# EAGLE design remote-tiny (EAGLE 4.16)
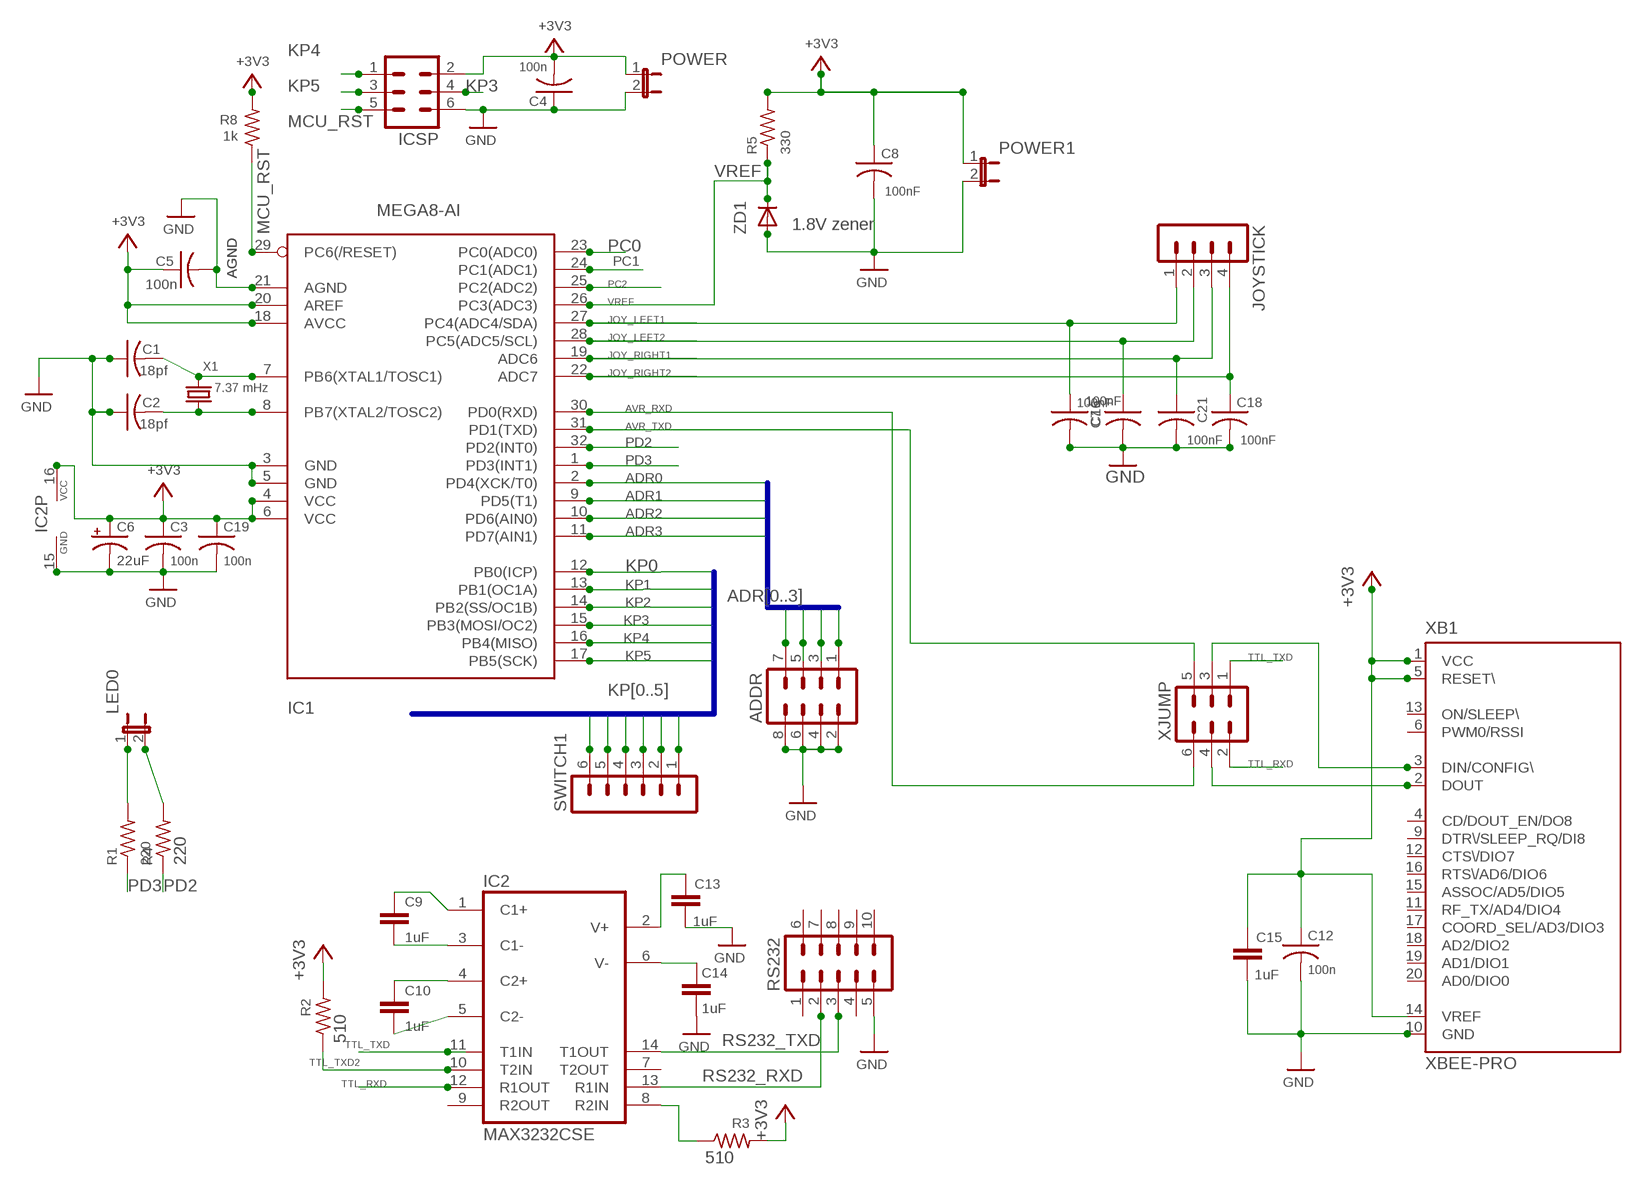
[diagram p0: schematic, sheet 1]

## Parts
ADDR  MA04-2  [MA04-2]
C1  18pf  C-USC1206  [C1206]
C2  18pf  C-USC1206  [C1206]
C3  100n  C-USC1206  [C1206]
C4  100n  C-USC1206  [C1206]
C5  100n  C-USC1206  [C1206]
C6  22uF  CPOL-USCT7343  [CT7343]
C7  100nF  C-USC1206  [C1206]
C8  100nF  C-USC1206  [C1206]
C9  1uF  C-EUC1206  [C1206]
C10  1uF  C-EUC1206  [C1206]
C12  100n  C-USC1206  [C1206]
C13  1uF  C-EUC1206  [C1206]
C14  1uF  C-EUC1206  [C1206]
C15  1uF  C-EUC1206  [C1206]
C16  100nF  C-USC1206  [C1206]
C18  100nF  C-USC1206  [C1206]
C19  100n  C-USC1206  [C1206]
C21  100nF  C-USC1206  [C1206]
IC1  MEGA8-AI  [TQFP32-08]
IC2  MAX3232CSE  [SO16]
ICSP  MA03-2  [MA03-2]
JOYSTICK  MA04-1  [MA04-1]
LED0  JP1E  [JP1]
POWER  JP1E  [JP1]
POWER1  JP1E  [JP1]
R1  220  R-US_M1206  [M1206]
R2  510  R-US_M1206  [M1206]
R3  510  R-US_M1206  [M1206]
R4  220  R-US_M1206  [M1206]
R5  330  R-US_M1206  [M1206]
R8  1k  R-US_M1206  [M1206]
RS232  COMHEADER-M  [MA05-2]
SWITCH1  MA06-1  [MA06-1]
X1  7.37 mHz  CRYSTALHC49UP  [HC49UP]
XB1  XBEE-PRO  [XBEE-PRO]
XJUMP  MA03-2  [MA03-2]
ZD1  1.8V zener  DIODE-SOD123  [SOD123]

## Nets
+3V3 [GND]: C3.1 C4.2 C5.1 C6.+ C8.1 C12.1 C15.1 C19.1 IC1.4(VCC) IC1.6(VCC) IC1.18(AVCC) IC1.20(AREF) IC2.16(VCC) ICSP.2 POWER1.1 POWER.1 R2.2 R3.2 R5.2 R8.2 XB1.1(VCC) XB1.5(RESET\) XB1.14(VREF)
ADR0: ADDR.7 IC1.2(PD4(XCK/T0))
ADR1: ADDR.5 IC1.9(PD5(T1))
ADR2: ADDR.3 IC1.10(PD6(AIN0))
ADR3: ADDR.1 IC1.11(PD7(AIN1))
AVR_RXD: IC1.30(PD0(RXD)) XJUMP.6
AVR_TXD: IC1.31(PD1(TXD)) XJUMP.5
GND [GND]: ADDR.2 ADDR.4 ADDR.6 ADDR.8 C1.1 C2.1 C3.2 C4.1 C5.2 C6.- C7.2 C8.2 C12.2 C13.2 C14.2 C15.2 C16.2 C18.2 C19.2 C21.2 IC1.3(GND) IC1.5(GND) IC1.21(AGND) IC2.15(GND) ICSP.6 POWER1.2 POWER.2 RS232.5 XB1.10(GND) ZD1.A
JOY_LEFT1: C16.1 IC1.27(PC4(ADC4/SDA)) JOYSTICK.1
JOY_LEFT2: C7.1 IC1.28(PC5(ADC5/SCL)) JOYSTICK.2
JOY_RIGHT1: C21.1 IC1.19(ADC6) JOYSTICK.3
JOY_RIGHT2: C18.1 IC1.22(ADC7) JOYSTICK.4
KP0: IC1.12(PB0(ICP)) SWITCH1.6
KP1: IC1.13(PB1(OC1A)) SWITCH1.5
KP2: IC1.14(PB2(SS/OC1B)) SWITCH1.4
KP3: IC1.15(PB3(MOSI/OC2)) ICSP.4 SWITCH1.3
KP4: IC1.16(PB4(MISO)) ICSP.1 SWITCH1.2
KP5: IC1.17(PB5(SCK)) ICSP.3 SWITCH1.1
MCU_RST: IC1.29(PC6(/RESET)) ICSP.5 R8.1
N$1: IC2.8(R2IN) R3.1
N$3: LED0.2 R4.2
N$4 [GND]: C1.2 IC1.7(PB6(XTAL1/TOSC1)) X1.2
N$5: LED0.1 R1.2
N$7: C14.1 IC2.6(V-)
N$9 [GND]: C2.2 IC1.8(PB7(XTAL2/TOSC2)) X1.1
N$10: C10.1 IC2.4(C2+)
N$11: C13.1 IC2.2(V+)
N$12: C10.2 IC2.5(C2-)
N$13: C9.2 IC2.3(C1-)
N$15: C9.1 IC2.1(C1+)
PC0: IC1.23(PC0(ADC0))
PC1: IC1.24(PC1(ADC1))
PC2: IC1.25(PC2(ADC2))
PD2: IC1.32(PD2(INT0)) R4.1
PD3: IC1.1(PD3(INT1)) R1.1
RS232_RXD: IC2.13(R1IN) RS232.2
RS232_TXD: IC2.14(T1OUT) RS232.3
TTL_RXD: IC2.12(R1OUT) XJUMP.2
TTL_TXD: IC2.11(T1IN) XJUMP.1
TTL_TXD2: IC2.10(T2IN) R2.1
VREF: IC1.26(PC3(ADC3)) R5.1 ZD1.C
XB_SEND: XB1.3(DIN/CONFIG\) XJUMP.3
XBEE_RCV: XB1.2(DOUT) XJUMP.4
Unconnected: IC2.7(T2OUT) IC2.9(R2OUT) RS232.1 RS232.4 RS232.6 RS232.7 RS232.8 RS232.9 RS232.10 XB1.4(CD/DOUT_EN/DO8) XB1.6(PWM0/RSSI) XB1.9(DTR\/SLEEP_RQ/DI8) XB1.11(RF_TX/AD4/DIO4) XB1.12(CTS\/DIO7) XB1.13(ON/SLEEP\) XB1.15(ASSOC/AD5/DIO5) XB1.16(RTS\/AD6/DIO6) XB1.17(COORD_SEL/AD3/DIO3) XB1.18(AD2/DIO2) XB1.19(AD1/DIO1) XB1.20(AD0/DIO0)

## Buses
ADR[0..3]
KP[0..5]

## Notes on the sheet
- AGND | AGND

## Library data of the parts
ADDR = con-lstb:MA04-2: PIN HEADER
C1-C5 C7 C8 C12 C16 C18 C19 C21 = rcl:C-US: CAPACITOR, American symbol
C6 = rcl:CPOL-US: POLARIZED CAPACITOR, American symbol
C9 C10 C13-C15 = rcl:C-EU: CAPACITOR, European symbol
IC1 = atmel:MEGA8: MICROCONTROLLER 8 Kbytes FLASH 1 kbytes SRAM 512 bytes EEPROM USART 6-channel 10 bit ADC 2-channel 8 bit ADC Source: avr.lbr
IC2 = maxim:MAX3232*: True RS-232 Transceivers 3.0V to 5.5V, Low-Power up to 1Mbps, Using Four 0.1µF External Capacitors Source: http://pdfserv.maxim-ic.com/en/ds/MAX3222-MAX3241.pdf
ICSP XJUMP = con-lstb:MA03-2: PIN HEADER
JOYSTICK = con-lstb:MA04-1: PIN HEADER
LED0 POWER POWER1 = jumper:JP1E: JUMPER
R1-R5 R8 = rcl:R-US_: RESISTOR, American symbol
RS232 = foote:COMHEADER-M
SWITCH1 = con-lstb:MA06-1: PIN HEADER
X1 = crystal:CRYSTAL: CRYSTAL
XB1 = maxstream:XBEE: XBee (TM) /XBee-PRO(TM) OEM RF Modules Source: MaxStream, Inc. xbee_productmanual.pdf
ZD1 = diode:DIODE-: DIODE

## Board
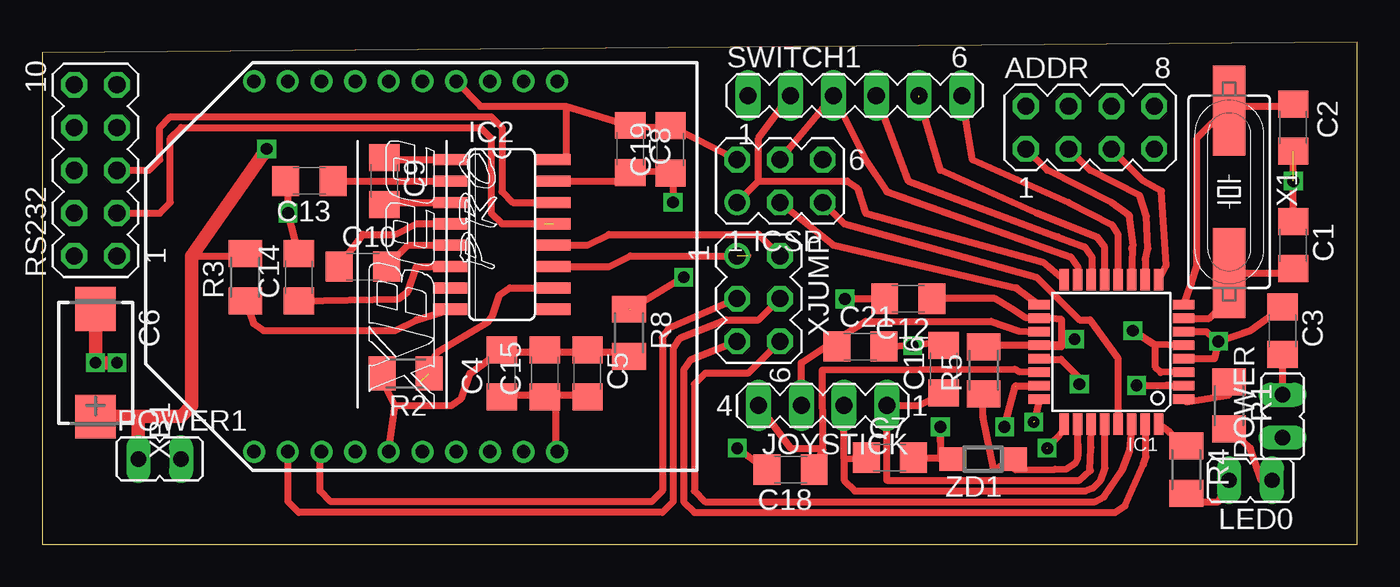
[diagram p1: board, top side]
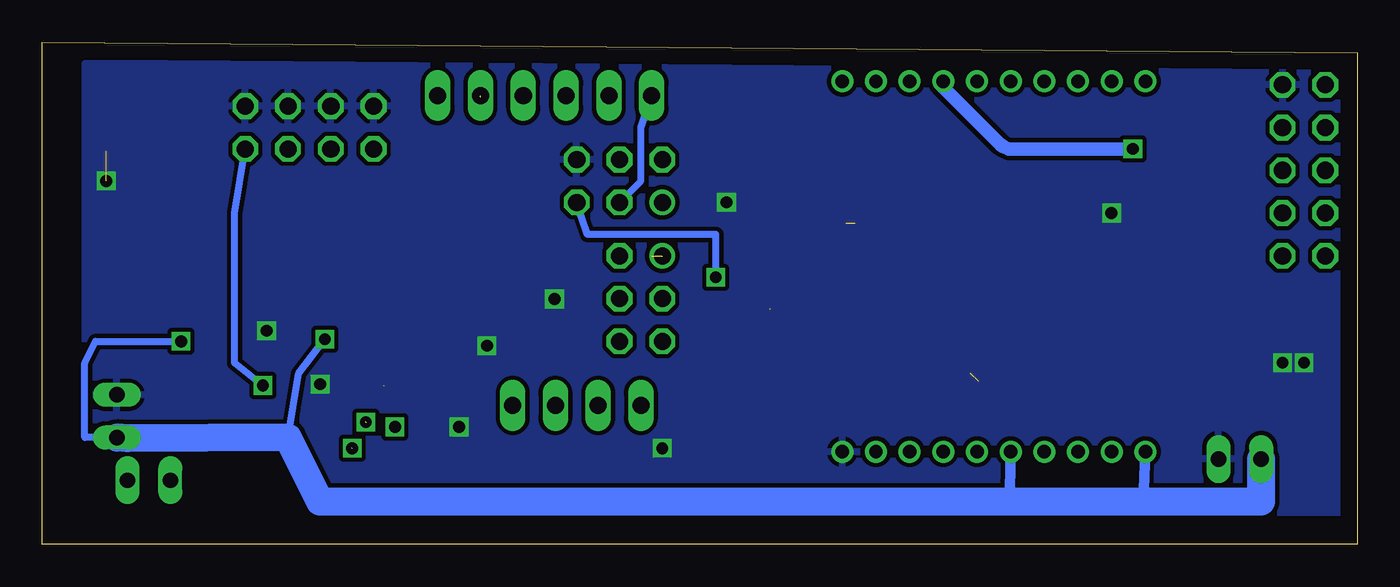
[diagram p2: board, bottom side, seen from below]

Size 78.11 x 29.84 mm. Coordinates in mm from the lower left corner, seen from the top.
Outline: 0,0 78.11,0 78.11,29.84 0,29.21 0,0
Copper layers (1*16): Top 0.035mm / dielectric 1.5mm / Bottom 0.035mm
Design rules "default": minimum track width 10mil, minimum drill 24mil, track to track 8mil, track to pad 8mil, pad to pad 8mil, via to via 8mil, smd to smd 8mil, copper to edge 40mil, drill to drill 8mil, minimum pad ring 10mil, minimum via ring 8mil, stop-mask expansion 4mil, vias tented up to drill 0mil, thermal gap 10mil

### Footprints (pad centres in the part's own frame; a part is rotated, then mirrored left to right if it is on the bottom)
MA04-2 = drill 1.016 octagon: 1 -3.81,-1.27; 2 -3.81,1.27; 3 -1.27,-1.27; 4 -1.27,1.27; 5 1.27,-1.27; 6 1.27,1.27; 7 3.81,-1.27; 8 3.81,1.27
C1206 = smd 1.6 x 1.8: 1 -1.4,0; 2 1.4,0
CT7343 = smd 2.6 x 2.4: + 3.2,0; - -3.2,0
TQFP32-08 = smd 1.27 x 0.559: 1 -4.293,2.8; 2 -4.293,2; 3 -4.293,1.2; 4 -4.293,0.4; 5 -4.293,-0.4; 6 -4.293,-1.2; 7 -4.293,-2; 8 -4.293,-2.8; 17 4.293,-2.8; 18 4.293,-2; 19 4.293,-1.2; 20 4.293,-0.4; 21 4.293,0.4; 22 4.293,1.2; 23 4.293,2; 24 4.293,2.8 | smd 0.559 x 1.27: 9 -2.8,-4.293; 10 -2,-4.293; 11 -1.2,-4.293; 12 -0.4,-4.293; 13 0.4,-4.293; 14 1.2,-4.293; 15 2,-4.293; 16 2.8,-4.293; 25 2.8,4.293; 26 2,4.293; 27 1.2,4.293; 28 0.4,4.293; 29 -0.4,4.293; 30 -1.2,4.293; 31 -2,4.293; 32 -2.8,4.293
SO16 = smd 0.66 x 2.032: 1 -4.445,-3.073; 2 -3.175,-3.073; 3 -1.905,-3.073; 4 -0.635,-3.073; 5 0.635,-3.073; 6 1.905,-3.073; 7 3.175,-3.073; 8 4.445,-3.073; 9 4.445,3.073; 10 3.175,3.073; 11 1.905,3.073; 12 0.635,3.073; 13 -0.635,3.073; 14 -1.905,3.073; 15 -3.175,3.073; 16 -4.445,3.073
MA03-2 = drill 1.016 round: 1 -2.54,-1.27 | drill 1.016 octagon: 2 -2.54,1.27; 3 0,-1.27; 4 0,1.27; 5 2.54,-1.27; 6 2.54,1.27
MA04-1 = drill 1.016 long: 1 -3.81,0; 2 -1.27,0; 3 1.27,0; 4 3.81,0
JP1 = drill 0.914 long: 1 0,-1.27; 2 0,1.27
M1206 = smd 1.6 x 2: 1 -1.4,0; 2 1.4,0
MA05-2 = drill 1.016 octagon: 1 -5.08,-1.27; 2 -2.54,-1.27; 3 0,-1.27; 4 2.54,-1.27; 5 5.08,-1.27; 6 -5.08,1.27; 7 -2.54,1.27; 8 0,1.27; 9 2.54,1.27; 10 5.08,1.27
MA06-1 = drill 1.016 long: 1 -6.35,0; 2 -3.81,0; 3 -1.27,0; 4 1.27,0; 5 3.81,0; 6 6.35,0
HC49UP = smd 5.334 x 1.93: 1 -4.826,0; 2 4.826,0
XBEE-PRO = drill 0.8 pad 1.27 round: 1 -11,9; 2 -11,7; 3 -11,5; 4 -11,3; 5 -11,1; 6 -11,-1; 7 -11,-3; 8 -11,-5; 9 -11,-7; 10 -11,-9; 11 11,-9; 12 11,-7; 13 11,-5; 14 11,-3; 15 11,-1; 16 11,1; 17 11,3; 18 11,5; 19 11,7; 20 11,9
SOD123 = smd 1.4 x 1.4: A 1.9,0; C -1.9,0

### Placement (x,y rotation side)
ADDR  62.23,24.77 0 top
C1  74.3,17.78 270 top
C2  74.3,24.77 90 top
C3  73.66,12.7 270 top
C4  27.3,10.16 90 top
C5  32.38,10.16 270 top
C6  3.17,10.79 270 top
C7  50.34,5.16 0 top
C8  34.92,23.5 270 top
C9  20.32,21.59 270 top
C10  19.05,16.51 0 top
C12  51.44,14.61 180 top
C13  15.88,21.59 180 top
C14  15.24,15.88 90 top
C15  29.84,10.16 270 top
C16  53.54,10.41 90 top
C18  44.45,4.45 180 top
C19  37.31,23.47 270 top
C21  48.59,11.76 0 top
IC1  63.5,11.43 180 top
IC2  27.3,18.41 270 top
ICSP  43.81,21.59 0 top
JOYSTICK  46.35,8.26 180 top
LED0  71.75,3.81 90 top
POWER  73.66,7.62 0 top
POWER1  6.99,5.08 270 top
R1  70.48,8.26 270 top
R2  21.59,10.16 180 top
R3  12.06,15.88 90 top
R4  67.94,4.45 270 top
R5  55.91,10.34 90 top
R8  34.85,12.57 270 top
RS232  3.17,22.22 90 top
SWITCH1  48.26,26.67 0 top
X1  70.48,20.95 270 top
XB1  21.59,16.51 90 top
XJUMP  42.55,14.61 270 top
ZD1  55.88,5.08 180 top

### Tracks (layer width: path | path; a pad name or v marks a point on that pad's centre or on a via)
+3V3  (via drill 0.7)
  Top 0.406: IC1.20 60.43,11.84 61.29,12.06 v61.32,12.19 | IC1.4 69.61,11.03 v69.85,12.06 | C3.1 71.75,12.7 v69.85,12.06 | IC1.6 69.14,12.63 v69.85,12.06 | IC1.18 | IC1.20 60.55,11.73 60.55,13.36 59.28,13.49 IC1.18 | R5.2 55.83,11.81 IC1.20 | C12.1 56.59,14.61 57.56,14.02 58.42,13.46 59.31,13.41 IC1.18 | XB1.1 12.7,5.71 | XB1.5 20.95,8.26 | 20.95,8.26 24.31,8.26 24.91,8.69 25.4,10.16 C4.2 27.3,11.43 29.84,11.43 C15.1 29.21,11.43 32.38,11.43 | 31.11,26.04 C8.1 36.83,24.77 C19.1 ICSP.2 | 31.11,26.04 31.11,22.86 IC2.16 | 31.11,26.04 26.04,26.04 XB1.14 | 8.89,17.14 12.06,17.14 R3.2 | 32.38,11.43 C5.1 | R2.2 20.32,9.53 20.95,8.26 | 32.38,11.43 34.29,11.43 34.92,10.79 R8.2
  Top 0.813: POWER1.1 5.71,7.62 | C6.+ 3.17,7.62 5.71,7.62 | 5.71,7.62 8.26,7.62 8.89,8.26 8.89,17.14 v13.34,23.5
  Bottom 0.406: v61.32,12.19 62.87,10.16 63.5,6.35 | v69.85,12.06 74.93,12.06 75.56,10.79 75.56,6.35 73.03,6.35 73.03,6.31
  Bottom 0.61: 20.62,2.54 20.62,3.35 XB1.5 | 5.71,2.54 12.7,2.54 XB1.1
  Bottom 0.813: XB1.14 24.77,27.3 21.23,23.77 21.02,23.63 20.69,23.5 v13.34,23.5
  Bottom 1.676: POWER1.1 5.71,2.54 20.62,2.54 61.59,2.54 63.5,6.35 73.03,6.31 POWER.1
ADR0  (via drill 0.7)
  Top 0.406: 66.78,9.45 IC1.2 | v65,9.45 66.78,9.45 | 66.78,9.45 66.89,9.45
  Bottom 0.406: v65,9.45 66.67,10.79 66.67,19.68 ADDR.7
ADR1
  Top 0.406: IC1.9 66.76,16.56 66.47,21.01 65.41,21.59 ADDR.5
ADR2
  Top 0.406: IC1.10 65.53,15.75 65.53,16.92 | 65.53,16.92 65.53,16.94 | 65.53,16.92 65.51,16.92 65.67,17.59 65.58,19.51 65.18,20.73 62.23,22.22 ADDR.3
ADR3
  Top 0.406: IC1.11 64.77,17.6 | 64.77,17.6 64.72,17.65 | 64.77,17.6 64.69,17.58 64.79,17.77 64.57,19.53 63.5,20.32 59.69,22.22 ADDR.1
AVR_RXD
  Top 0.406: XJUMP.6 41.91,10.16 39.37,10.16 38.73,9.53 38.73,3.17 39.37,2.54 62.52,2.54 63.05,2.82 64.14,4.45 64.59,5.59 64.75,7.11 IC1.30
AVR_TXD
  Top 0.406: IC1.31 65.53,7.09 65.53,5.23 65.56,5.23 65.41,4.75 64.3,2.28 63.72,1.91 38.73,1.91 38.1,2.54 38.1,10.37 38.5,10.96 XJUMP.5
GND  (via drill 0.7)  (1 unrouted)
  Top 0.406: IC1.21 59.24,11 60.5,11 61.59,9.91 v61.59,9.53 | 14.61,17.14 C14.2 v14.61,19.68 14.61,21.46 C13.2 | C18.2 v41.27,5.71 | C21.2 v51.69,11.81 53.34,12.06 C16.2 | C7.2 53.37,5.16 v53.34,6.98 53.34,5.08 ZD1.A | IC1.5 65.94,11.91 v64.77,12.7 66.12,11.84 66.12,10.52 66.42,10.21 IC1.3 | 74.3,19.05 C1.1 C2.1 | POWER.2 C3.2 | v47.68,14.58 47.7,14.61 C12.2 | IC2.15 34.92,21.59 C8.2 37.47,22.22 C19.2 37.47,21.59 v37.47,20.32 | C4.1 27.3,8.89 29.84,8.89 | C5.2 32.38,8.89 29.84,8.89 | 29.84,8.89 C15.2 30.48,8.89 30.48,5.71 XB1.10
  Top 0.813: C6.- v3.17,10.79 v4.45,10.79
  other vias: 74.3,21.59
  pour Bottom (isolate 0.254, rank 2): 0.64,1.91 -0.64,30.48 75.56,28.57 75.56,2.54 74.93,1.91
JOY_LEFT1
  Top 0.406: IC1.27 62.28,5.74 62.23,4.45 62.23,4.39 62.26,4.39 61.59,3.81 50.16,3.81 JOYSTICK.1 52.07,8.26 C16.1
JOY_LEFT2
  Top 0.406: IC1.28 63.09,5.51 63.09,5.28 | 63.09,5.28 63.09,4.67 63.12,4.52 | 63.12,4.52 63.09,5.28 | 47.62,5.08 JOYSTICK.2 | 47.62,5.08 47.62,3.81 48.26,3.17 61.97,3.17 62.42,3.36 62.87,3.81 63.09,4.5 63.12,4.52 | 47.62,5.08 C7.1
JOY_RIGHT1
  Top 0.406: IC1.19 59.43,12.6 58.01,12.67 56.36,13.26 48.9,13.26 46.91,11.99 | 46.91,11.99 45.09,10.79 JOYSTICK.3 | C21.1 47.19,11.73 46.91,11.99
JOY_RIGHT2
  Top 0.406: IC1.22 59.44,10.29 58.04,10.26 57.76,10.41 46.33,10.36 46.35,5.71 | 46.35,5.71 44.45,5.71 JOYSTICK.4 | 46.35,5.71 C18.1
KP0
  Top 0.406: IC1.12 63.88,15.74 63.88,18.43 63.54,19 60.96,20.32 55.24,22.86 SWITCH1.6
KP1  (1 unrouted)
  Top 0.406: IC1.13 63.09,17.65 62.69,18.24 59.05,19.68 53.34,22.22 52.07,26.57
KP2
  Top 0.406: IC1.14 62.33,15.75 62.33,17.08 61.91,17.68 60.33,18.26 51.44,21.59 SWITCH1.4
KP3
  Top 0.406: IC1.15 61.5,16.49 61.08,17.09 50.16,20.95 48.9,22.86 SWITCH1.3 ICSP.4
KP4
  Top 0.406: IC1.16 59.43,16.77 48.9,19.68 48.41,21.16 47.8,21.59 42.55,21.59 | SWITCH1.2 42.55,24.13 42.55,21.59 | ICSP.1 42.55,21.59
KP5
  Top 0.406: IC1.17 57.84,15.24 57.86,15.24 46.99,17.78 ICSP.3
  Bottom 0.406: SWITCH1.1 42.55,24.77 42.55,21.59 ICSP.3
MCU_RST  (via drill 0.7)  (1 unrouted)
  Top 0.406: IC1.29 63.9,7.79 63.88,7.8 63.88,11.05 62.23,13.33 61.59,13.33 59.05,15.88 47.62,19.05 ICSP.5 | 34.92,13.97 v38.1,15.88
  Bottom 0.406: ICSP.5 45.72,18.41 38.1,18.41 v38.1,15.88
N$1
  Top 0.406: IC2.8 22.23,13.33 20.95,12.7 13.15,12.7 12.55,13.12 R3.1
N$3
  Top 0.406: LED0.2 69.85,2.54 67.31,2.54 R4.2
N$4
  Top 0.406: IC1.7 69.31,13.43 69.85,13.97 69.85,15.24 70.48,15.88 X1.2 74.04,16.13 74.3,15.88 C1.2
N$5
  Top 0.406: R1.2 71.75,5.71 72.39,3.81 LED0.1
N$7
  Top 0.406: C14.1 21.14,14.6 21.73,15.03 22.23,16.51 IC2.6
N$9
  Top 0.406: IC1.8 68.25,15.49 68.58,16.51 68.58,24.13 70.48,26.04 X1.1 71.12,26.04 74.3,26.04 C2.2
N$10
  Top 0.406: IC2.4 22.23,19.05 20.95,18.41 19.05,18.41 C10.1
N$11
  Top 0.406: 17.14,21.59 C13.1 IC2.2
N$12
  Top 0.406: C10.2 21.72,17.78 IC2.5 24.77,17.78
N$13
  Top 0.406: C9.2 20.32,20.32 IC2.3
N$15
  Top 0.406: C9.1 20.32,22.86 IC2.1
PC0  (via drill 0.7)  (1 unrouted)
  Top 0.406: IC1.23 57.84,9.42 | v57.15,6.98 57.81,9.42
PC1  (via drill 0.7)  (1 unrouted)
  Top 0.406: 59.04,7.39 58.93,7.31 IC1.24
  other vias: 58.88,7.26
PC2  (via drill 0.7)  (1 unrouted)
  Top 0.406: IC1.25 60.71,6.81 59.69,5.74
  other vias: 59.69,5.71
PD2
  Top 0.406: IC1.32 66.95,6.65 67.94,5.71 R4.1
PD3
  Top 0.406: IC1.1 67.94,8.48 70.48,8.89 R1.1
RS232_RXD  (1 unrouted)
  Top 0.406: RS232.2 6.99,19.68 7.62,20.32 7.62,24.13 8.26,24.77 26.04,24.77 26.67,24.13 26.67,19.68 27.3,19.05 29.84,19.05
RS232_TXD
  Top 0.406: RS232.3 6.35,22.22 6.99,22.86 6.99,24.77 7.62,25.4 26.67,25.4 27.3,24.77 27.3,20.95 27.94,20.32 IC2.14
TTL_RXD
  Top 0.406: IC2.12 32.38,17.78 33.66,18.41 42.55,18.41 XJUMP.2
TTL_TXD  (1 unrouted)
  Top 0.406: IC2.11 33.66,16.51 34.92,17.14 41.91,17.14
TTL_TXD2  (1 unrouted)
  Top 0.406: IC2.10 27.76,15.24 27.16,14.81 26.74,13.56 26.47,13.21 23.5,11.43 22.48,9.68
VREF
  Top 0.406: 61.49,5.97 IC1.26 | 61.49,5.97 61.49,5.23 | 61.49,5.97 61.49,5.11 61.38,4.86 60.82,4.49 60.15,4.47 57.78,4.45 ZD1.C 56.52,4.45 55.88,7.62 R5.1
XB_SEND
  Top 0.406: XB1.3 16.51,5.08 16.51,3.17 17.14,2.54 36.2,2.54 36.83,3.17 36.83,12.28 37.22,12.87 XJUMP.3
XBEE_RCV
  Top 0.406: XJUMP.4 42.55,13.33 40.64,13.33 37.86,12.22 37.47,11.63 37.47,2.54 36.83,1.91 15.24,1.91 14.61,2.54 14.61,5.08 XB1.2

### Text on the board
Top: remote rev0 2008 | SWARM | orbswarm.com
_tsilk: 1 | R7 | SPU_COM2 | AGGREGATOR | STEER_POT | 100nF | C20 | C5 | 100n | 1 | 1 | IMU1 | 100nF | C6 | 1 | SPU_DIO2 | R3 | 1uF | 100nF | C16 | C7 | C15 | COM_OB | 1 | ENCODER | SPU_LCD | R2 | C11 | 100n | R8 | IC1 | 100n | C3 | 1 | 18pf | R4 | SPU_COM3 | MEGA8-AI | C1 | ICSP | X1 | L1 | 10uH | 330 | C2 | R1 | RESET | 1 | 18pf | +++ | SPU_DIO1 | C4 | 100n | C19 | HEARTBEAT | PC_104 | 100n | C17 | 12V | GND | IC2 | C8 | 1uF | 100n | C13 | 1uF | C9 | +5V | GND | C10 | R9 | R5 | ZD1 | C14 | 1uF | 1uF | +++ | R6 | COM4_RS232 | COM3_RS232 | H-BRIDGE | C12 | 100n | C18 | 1 | 1 | 1
_bsilk: 1 | 1 | 1